# Altium schematic sheet 08_DDR3L_Modules.SchDoc
size A3; SheetNumber: 8; SheetTotal: 9
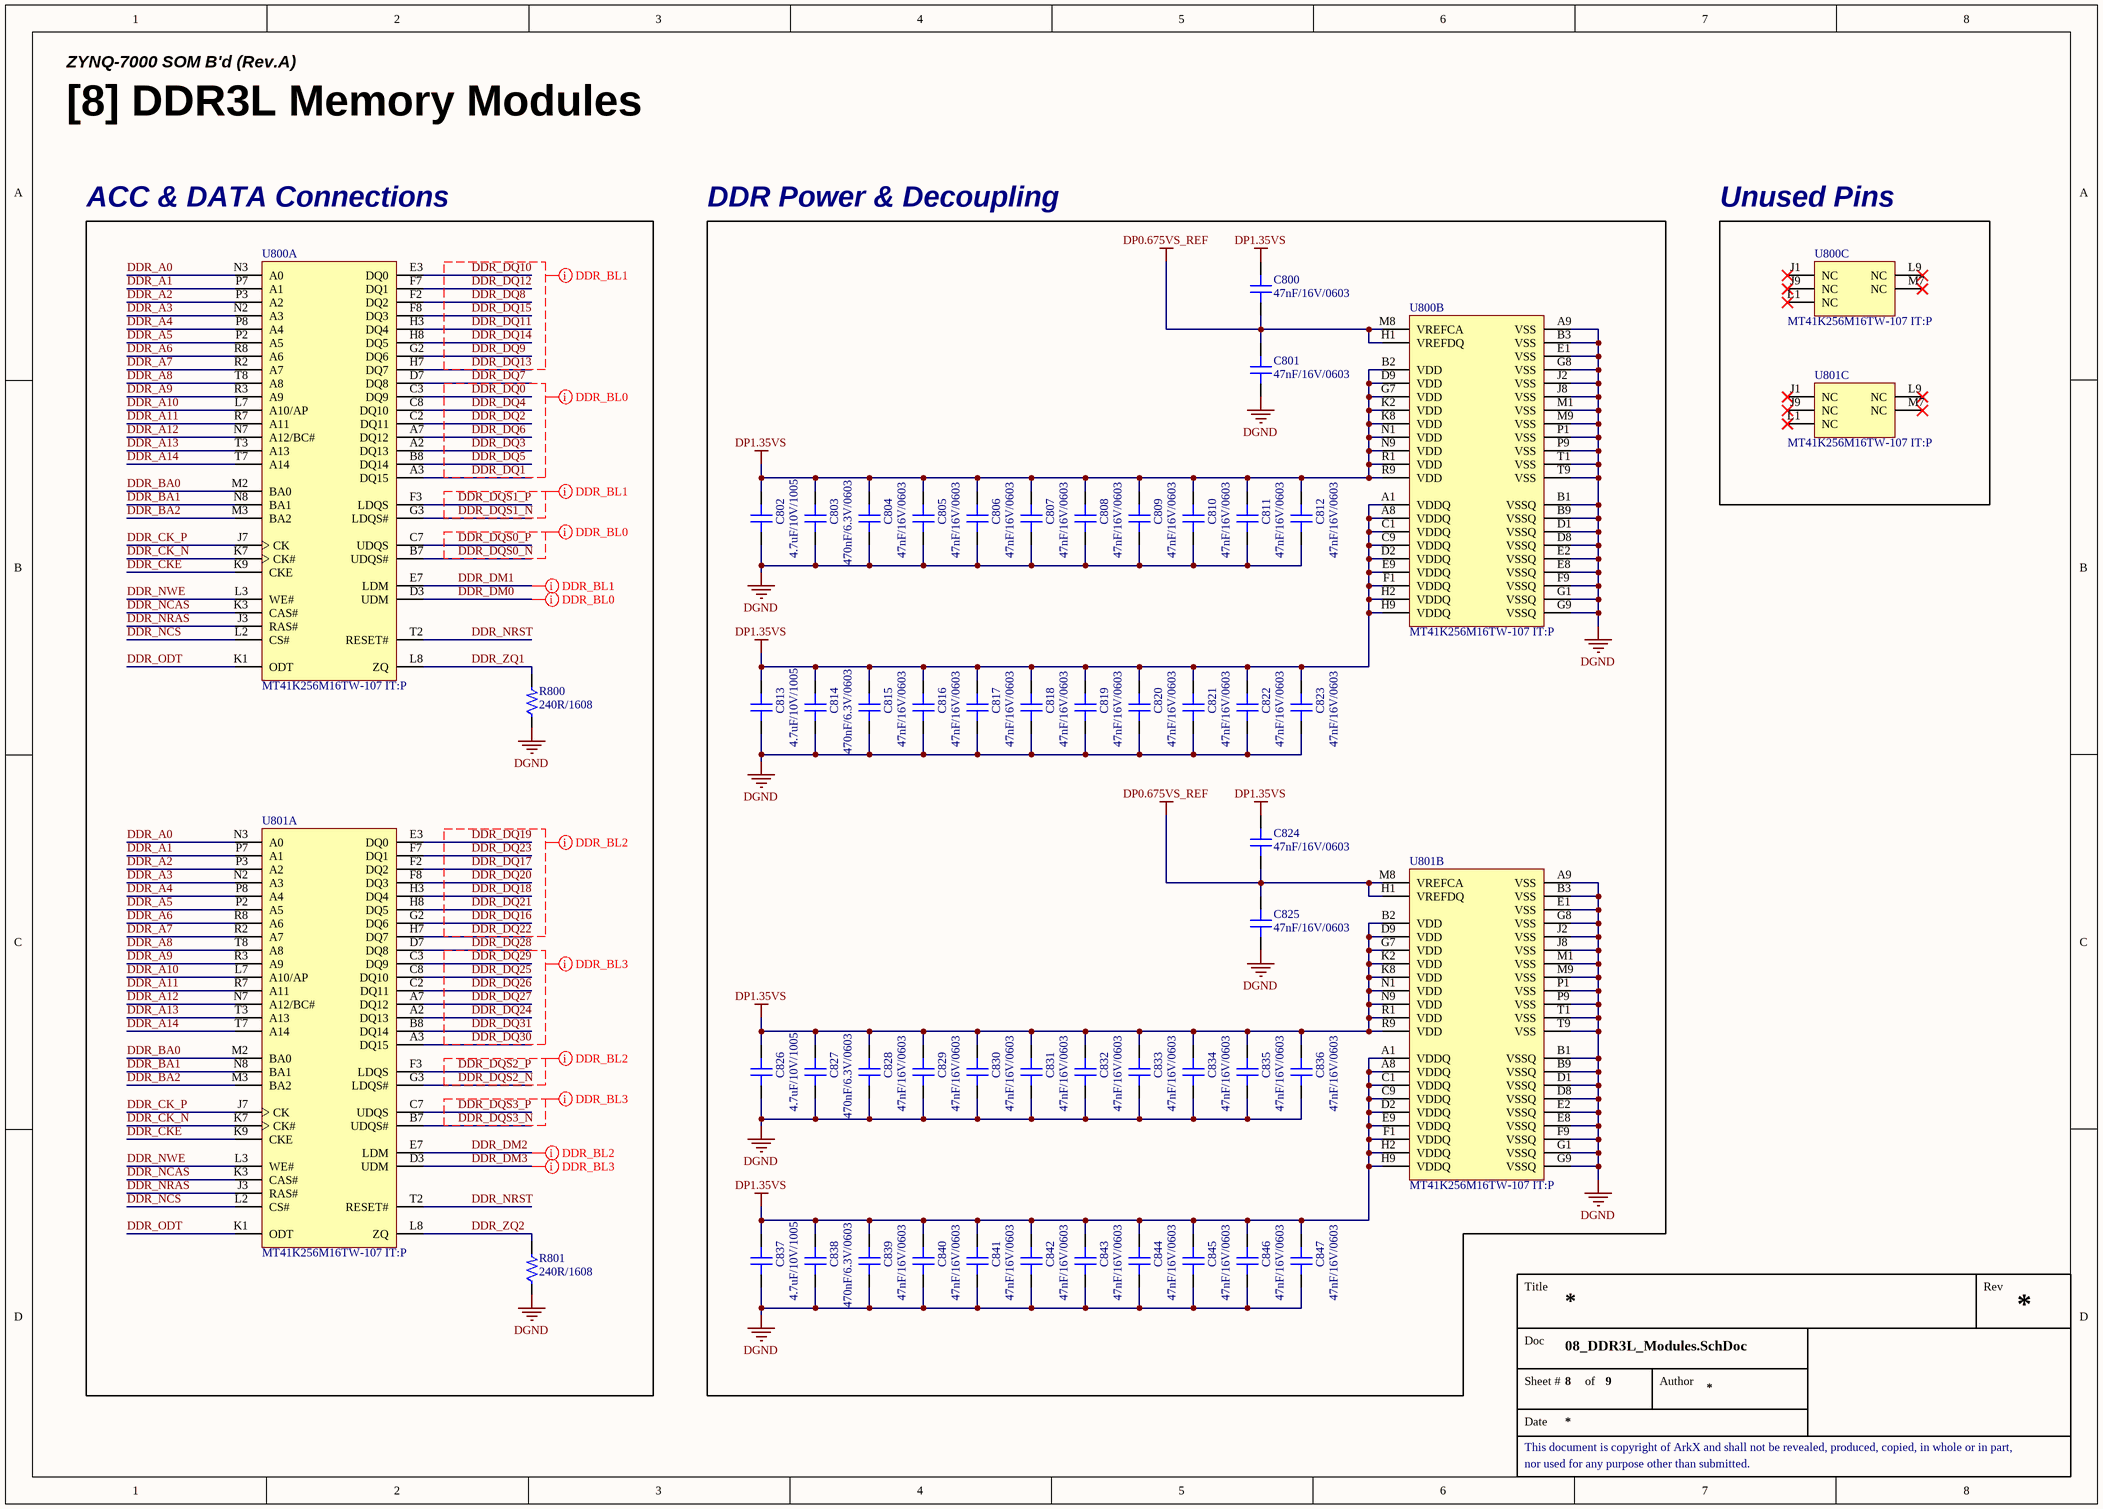
[diagram p0: 08_DDR3L_Modules.SchDoc]

## Parts
C800  47nF/16V/0603  [CAP 0603 (0201_INCH)]
C801  47nF/16V/0603  [CAP 0603 (0201_INCH)]
C802  4.7uF/10V/1005  [CAP 1005 (0402_INCH)]
C803  470nF/6.3V/0603  [CAP 0603 (0201_INCH)]
C804  47nF/16V/0603  [CAP 0603 (0201_INCH)]
C805  47nF/16V/0603  [CAP 0603 (0201_INCH)]
C806  47nF/16V/0603  [CAP 0603 (0201_INCH)]
C807  47nF/16V/0603  [CAP 0603 (0201_INCH)]
C808  47nF/16V/0603  [CAP 0603 (0201_INCH)]
C809  47nF/16V/0603  [CAP 0603 (0201_INCH)]
C810  47nF/16V/0603  [CAP 0603 (0201_INCH)]
C811  47nF/16V/0603  [CAP 0603 (0201_INCH)]
C812  47nF/16V/0603  [CAP 0603 (0201_INCH)]
C813  4.7uF/10V/1005  [CAP 1005 (0402_INCH)]
C814  470nF/6.3V/0603  [CAP 0603 (0201_INCH)]
C815  47nF/16V/0603  [CAP 0603 (0201_INCH)]
C816  47nF/16V/0603  [CAP 0603 (0201_INCH)]
C817  47nF/16V/0603  [CAP 0603 (0201_INCH)]
C818  47nF/16V/0603  [CAP 0603 (0201_INCH)]
C819  47nF/16V/0603  [CAP 0603 (0201_INCH)]
C820  47nF/16V/0603  [CAP 0603 (0201_INCH)]
C821  47nF/16V/0603  [CAP 0603 (0201_INCH)]
C822  47nF/16V/0603  [CAP 0603 (0201_INCH)]
C823  47nF/16V/0603  [CAP 0603 (0201_INCH)]
C824  47nF/16V/0603  [CAP 0603 (0201_INCH)]
C825  47nF/16V/0603  [CAP 0603 (0201_INCH)]
C826  4.7uF/10V/1005  [CAP 1005 (0402_INCH)]
C827  470nF/6.3V/0603  [CAP 0603 (0201_INCH)]
C828  47nF/16V/0603  [CAP 0603 (0201_INCH)]
C829  47nF/16V/0603  [CAP 0603 (0201_INCH)]
C830  47nF/16V/0603  [CAP 0603 (0201_INCH)]
C831  47nF/16V/0603  [CAP 0603 (0201_INCH)]
C832  47nF/16V/0603  [CAP 0603 (0201_INCH)]
C833  47nF/16V/0603  [CAP 0603 (0201_INCH)]
C834  47nF/16V/0603  [CAP 0603 (0201_INCH)]
C835  47nF/16V/0603  [CAP 0603 (0201_INCH)]
C836  47nF/16V/0603  [CAP 0603 (0201_INCH)]
C837  4.7uF/10V/1005  [CAP 1005 (0402_INCH)]
C838  470nF/6.3V/0603  [CAP 0603 (0201_INCH)]
C839  47nF/16V/0603  [CAP 0603 (0201_INCH)]
C840  47nF/16V/0603  [CAP 0603 (0201_INCH)]
C841  47nF/16V/0603  [CAP 0603 (0201_INCH)]
C842  47nF/16V/0603  [CAP 0603 (0201_INCH)]
C843  47nF/16V/0603  [CAP 0603 (0201_INCH)]
C844  47nF/16V/0603  [CAP 0603 (0201_INCH)]
C845  47nF/16V/0603  [CAP 0603 (0201_INCH)]
C846  47nF/16V/0603  [CAP 0603 (0201_INCH)]
C847  47nF/16V/0603  [CAP 0603 (0201_INCH)]
R800  240R/1608  [RES 1608 (0603_inch)]
R801  240R/1608  [RES 1608 (0603_inch)]
U800  MT41K256M16TW-107 IT:P  [IC_MEM_DDR3L_MT41K256M16TW-107 IT:P]  (parts A,B,C of 3)
U801  MT41K256M16TW-107 IT:P  [IC_MEM_DDR3L_MT41K256M16TW-107 IT:P]  (parts A,B,C of 3)

## Blocks framed on the sheet
ACC & DATA Connections: R800 R801 U800 U801
DDR Power & Decoupling: C800-C847 U800 U801
Unused Pins: U800 U801

## Nets
DGND: C801.1 C802.1 C803.1 C804.1 C805.1 C806.1 C807.1 C808.1 C809.1 C810.1 C811.1 C812.1 C813.1 C814.1 C815.1 C816.1 C817.1 C818.1 C819.1 C820.1 C821.1 C822.1 C823.1 C825.1 C826.1 C827.1 C828.1 C829.1 C830.1 C831.1 C832.1 C833.1 C834.1 C835.1 C836.1 C837.1 C838.1 C839.1 C840.1 C841.1 C842.1 C843.1 C844.1 C845.1 C846.1 C847.1 R800.1 R801.1 U800.A9(VSS) U800.B1(VSSQ) U800.B3(VSS) U800.B9(VSSQ) U800.D1(VSSQ) U800.D8(VSSQ) U800.E1(VSS) U800.E2(VSSQ) U800.E8(VSSQ) U800.F9(VSSQ) U800.G1(VSSQ) U800.G8(VSS) U800.G9(VSSQ) U800.J2(VSS) U800.J8(VSS) U800.M1(VSS) U800.M9(VSS) U800.P1(VSS) U800.P9(VSS) U800.T1(VSS) U800.T9(VSS) U801.A9(VSS) U801.B1(VSSQ) U801.B3(VSS) U801.B9(VSSQ) U801.D1(VSSQ) U801.D8(VSSQ) U801.E1(VSS) U801.E2(VSSQ) U801.E8(VSSQ) U801.F9(VSSQ) U801.G1(VSSQ) U801.G8(VSS) U801.G9(VSSQ) U801.J2(VSS) U801.J8(VSS) U801.M1(VSS) U801.M9(VSS) U801.P1(VSS) U801.P9(VSS) U801.T1(VSS) U801.T9(VSS)
DP0.675VS_REF: C800.1 C801.2 C824.1 C825.2 U800.H1(VREFDQ) U800.M8(VREFCA) U801.H1(VREFDQ) U801.M8(VREFCA)
DP1.35VS: C800.2 C802.2 C803.2 C804.2 C805.2 C806.2 C807.2 C808.2 C809.2 C810.2 C811.2 C812.2 C813.2 C814.2 C815.2 C816.2 C817.2 C818.2 C819.2 C820.2 C821.2 C822.2 C823.2 C824.2 C826.2 C827.2 C828.2 C829.2 C830.2 C831.2 C832.2 C833.2 C834.2 C835.2 C836.2 C837.2 C838.2 C839.2 C840.2 C841.2 C842.2 C843.2 C844.2 C845.2 C846.2 C847.2 U800.A1(VDDQ) U800.A8(VDDQ) U800.B2(VDD) U800.C1(VDDQ) U800.C9(VDDQ) U800.D2(VDDQ) U800.D9(VDD) U800.E9(VDDQ) U800.F1(VDDQ) U800.G7(VDD) U800.H2(VDDQ) U800.H9(VDDQ) U800.K2(VDD) U800.K8(VDD) U800.N1(VDD) U800.N9(VDD) U800.R1(VDD) U800.R9(VDD) U801.A1(VDDQ) U801.A8(VDDQ) U801.B2(VDD) U801.C1(VDDQ) U801.C9(VDDQ) U801.D2(VDDQ) U801.D9(VDD) U801.E9(VDDQ) U801.F1(VDDQ) U801.G7(VDD) U801.H2(VDDQ) U801.H9(VDDQ) U801.K2(VDD) U801.K8(VDD) U801.N1(VDD) U801.N9(VDD) U801.R1(VDD) U801.R9(VDD)
DDR_A0: U800.N3(A0) U801.N3(A0)
DDR_A1: U800.P7(A1) U801.P7(A1)
DDR_A2: U800.P3(A2) U801.P3(A2)
DDR_A3: U800.N2(A3) U801.N2(A3)
DDR_A4: U800.P8(A4) U801.P8(A4)
DDR_A5: U800.P2(A5) U801.P2(A5)
DDR_A6: U800.R8(A6) U801.R8(A6)
DDR_A7: U800.R2(A7) U801.R2(A7)
DDR_A8: U800.T8(A8) U801.T8(A8)
DDR_A9: U800.R3(A9) U801.R3(A9)
DDR_A10: U800.L7(A10/AP) U801.L7(A10/AP)
DDR_A11: U800.R7(A11) U801.R7(A11)
DDR_A12: U800.N7(A12/BC#) U801.N7(A12/BC#)
DDR_A13: U800.T3(A13) U801.T3(A13)
DDR_A14: U800.T7(A14) U801.T7(A14)
DDR_BA0: U800.M2(BA0) U801.M2(BA0)
DDR_BA1: U800.N8(BA1) U801.N8(BA1)
DDR_BA2: U800.M3(BA2) U801.M3(BA2)
DDR_CK_N: U800.K7(CK#) U801.K7(CK#)
DDR_CK_P: U800.J7(CK) U801.J7(CK)
DDR_CKE: U800.K9(CKE) U801.K9(CKE)
DDR_DM0: U800.D3(UDM)
DDR_DM1: U800.E7(LDM)
DDR_DM2: U801.E7(LDM)
DDR_DM3: U801.D3(UDM)
DDR_DQ0: U800.C3(DQ9)
DDR_DQ1: U800.A3(DQ15)
DDR_DQ2: U800.C2(DQ11)
DDR_DQ3: U800.A2(DQ13)
DDR_DQ4: U800.C8(DQ10)
DDR_DQ5: U800.B8(DQ14)
DDR_DQ6: U800.A7(DQ12)
DDR_DQ7: U800.D7(DQ8)
DDR_DQ8: U800.F2(DQ2)
DDR_DQ9: U800.G2(DQ6)
DDR_DQ10: U800.E3(DQ0)
DDR_DQ11: U800.H3(DQ4)
DDR_DQ12: U800.F7(DQ1)
DDR_DQ13: U800.H7(DQ7)
DDR_DQ14: U800.H8(DQ5)
DDR_DQ15: U800.F8(DQ3)
DDR_DQ16: U801.G2(DQ6)
DDR_DQ17: U801.F2(DQ2)
DDR_DQ18: U801.H3(DQ4)
DDR_DQ19: U801.E3(DQ0)
DDR_DQ20: U801.F8(DQ3)
DDR_DQ21: U801.H8(DQ5)
DDR_DQ22: U801.H7(DQ7)
DDR_DQ23: U801.F7(DQ1)
DDR_DQ24: U801.A2(DQ13)
DDR_DQ25: U801.C8(DQ10)
DDR_DQ26: U801.C2(DQ11)
DDR_DQ27: U801.A7(DQ12)
DDR_DQ28: U801.D7(DQ8)
DDR_DQ29: U801.C3(DQ9)
DDR_DQ30: U801.A3(DQ15)
DDR_DQ31: U801.B8(DQ14)
DDR_DQS0_N: U800.B7(UDQS#)
DDR_DQS0_P: U800.C7(UDQS)
DDR_DQS1_N: U800.G3(LDQS#)
DDR_DQS1_P: U800.F3(LDQS)
DDR_DQS2_N: U801.G3(LDQS#)
DDR_DQS2_P: U801.F3(LDQS)
DDR_DQS3_N: U801.B7(UDQS#)
DDR_DQS3_P: U801.C7(UDQS)
DDR_NCAS: U800.K3(CAS#) U801.K3(CAS#)
DDR_NCS: U800.L2(CS#) U801.L2(CS#)
DDR_NRAS: U800.J3(RAS#) U801.J3(RAS#)
DDR_NRST: U800.T2(RESET#) U801.T2(RESET#)
DDR_NWE: U800.L3(WE#) U801.L3(WE#)
DDR_ODT: U800.K1(ODT) U801.K1(ODT)
DDR_ZQ1: R800.2 U800.L8(ZQ)
DDR_ZQ2: R801.2 U801.L8(ZQ)

Not connected (* = marked no-connect by the designer): U800 J1(NC)* J9(NC)* L1(NC)* L9(NC)* M7(NC)*; U801 J1(NC)* J9(NC)* L1(NC)* L9(NC)* M7(NC)*

## Layout directives
net class DDR_BL0; rule Matched Net Lengths [Delay Tolerance = 10ps]: DDR_DM0, DDR_DQ0, DDR_DQ1, DDR_DQ2, DDR_DQ3, DDR_DQ4, DDR_DQ5, DDR_DQ6, DDR_DQ7, DDR_DQS0_N, DDR_DQS0_P
net class DDR_BL1; rule Matched Net Lengths [Delay Tolerance = 10ps]: DDR_DM1, DDR_DQ8, DDR_DQ9, DDR_DQ10, DDR_DQ11, DDR_DQ12, DDR_DQ13, DDR_DQ14, DDR_DQ15, DDR_DQS1_N, DDR_DQS1_P
net class DDR_BL2; rule Matched Net Lengths [Delay Tolerance = 10ps]: DDR_DM2, DDR_DQ16, DDR_DQ17, DDR_DQ18, DDR_DQ19, DDR_DQ20, DDR_DQ21, DDR_DQ22, DDR_DQ23, DDR_DQS2_N, DDR_DQS2_P
net class DDR_BL3; rule Matched Net Lengths [Delay Tolerance = 10ps]: DDR_DM3, DDR_DQ24, DDR_DQ25, DDR_DQ26, DDR_DQ27, DDR_DQ28, DDR_DQ29, DDR_DQ30, DDR_DQ31, DDR_DQS3_N, DDR_DQS3_P

## Notes on the sheet
- ZYNQ-7000 SOM B'd (Rev.A)
- [8] DDR3L Memory Modules
- Title
- Rev
- Doc
- Sheet #
- of
- Author
- This document is copyright of ArkX and shall not be revealed, produced, copied, in whole or in part,
- Date
- nor used for any purpose other than submitted.

## Library data of the parts
C800 C801 C804-C812 C815-C825 C828-C836 C839-C847 = CAP_47nF/16V/0603: 16V 47nF X5R ±10% 0201 Multilayer Ceramic Capacitors MLCC - SMD/SMT ROHS; JLCPCB Part Type: Extended Part; LCSC Part #: C88917
C802 C813 C826 C837 = CAP_4.7uF/10V/1005: 10V 4.7uF X5R ±20% 0402  Multilayer Ceramic Capacitors MLCC - SMD/SMT ROHS; JLCPCB Part Type: Basic Part; LCSC Part #: C23733
C803 C814 C827 C838 = CAP_470nF/6.3V/0603: 6.3V 470nF X5R ±10% 0201  Multilayer Ceramic Capacitors MLCC - SMD/SMT ROHS; JLCPCB Part Type: Extended Part; LCSC Part #: C85926
R800 R801 = RES_240R/1608/0.1W: Value: 240R; Power Rating: 0.1W; Precision: 1%; Size: 1608; LCSC Part #: C23350; JLCPCB Part Type: Basic Part
U800 U801 = IC_MEM_DDR3L_MT41K256M16TW-107 IT:P: SDRAM - DDR3L Memory IC 4Gbit Parallel 933 MHz 20 ns 96-FBGA (8x14); JLCPCB Part Type: Extended Part; LCSC Part #: C367428